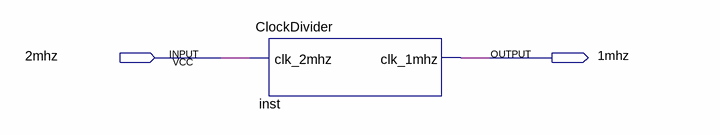
[diagram p0: schematic sheet]
// Quartus schematic clockDivider.bdf as structural Verilog: 1 symbols, 2 pins
module clockDivider (
  input  \2mhz ,
  output \1mhz 
);

  ClockDivider inst (.clk_2mhz(\2mhz ), .clk_1mhz(\1mhz ));
endmodule
